# EAGLE design 8-Bit Instruction Register (EAGLE 7.5.0)
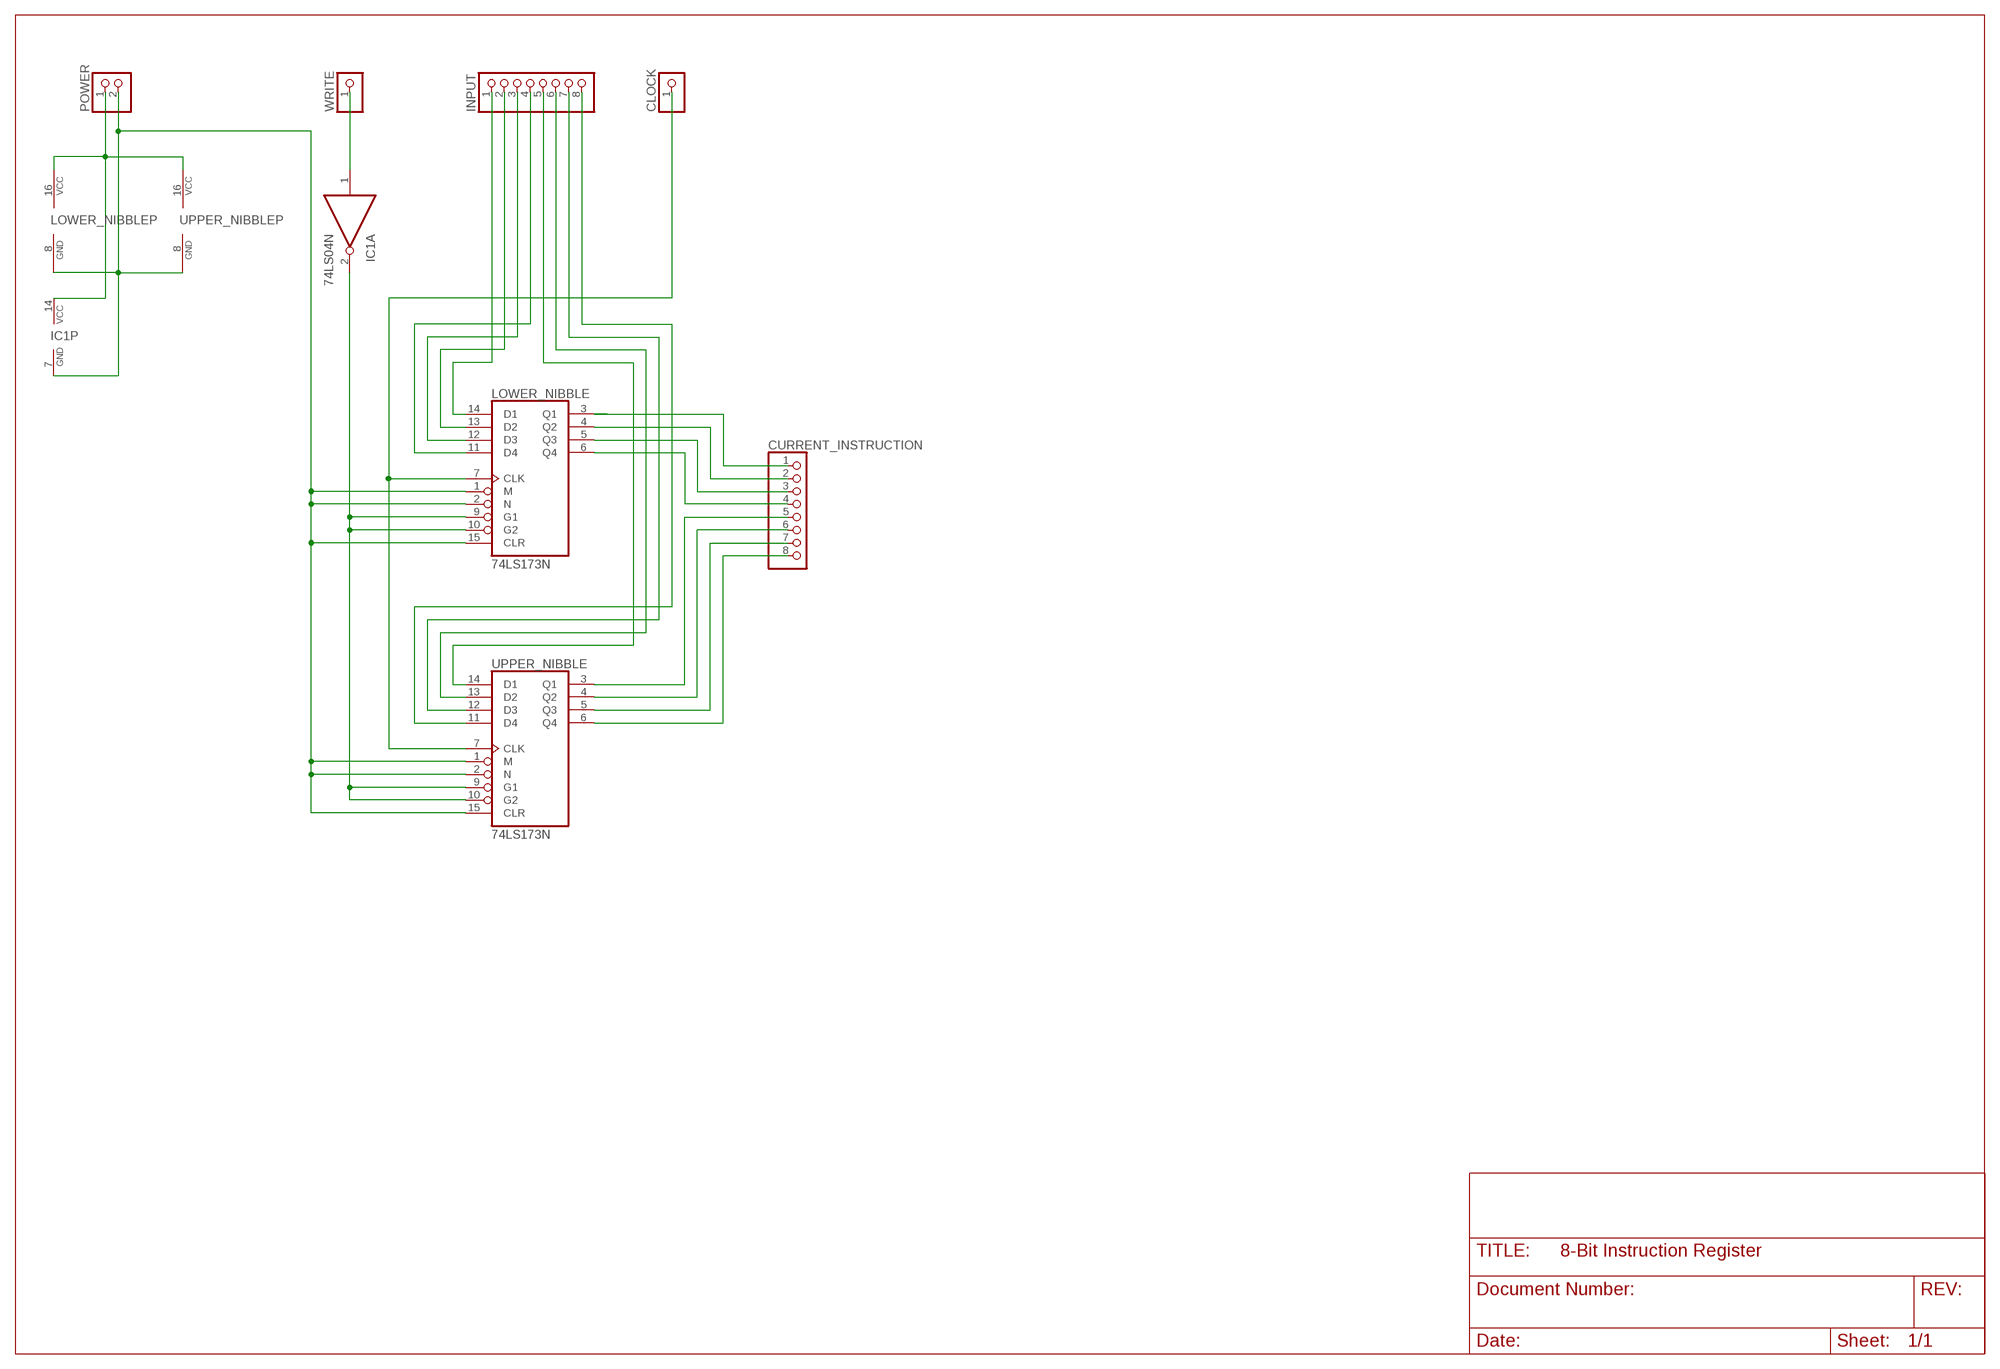
[diagram p0: schematic, sheet 1]

## Parts
CLOCK  PINHD-1X1  [1X01]
CURRENT_INSTRUCTION  PINHD-1X8  [1X08]
IC1  74LS04N  [DIL14]
INPUT  PINHD-1X8  [1X08]
LOWER_NIBBLE  74LS173N  [DIL16]
POWER  PINHD-1X2  [1X02]
UPPER_NIBBLE  74LS173N  [DIL16]
WRITE  PINHD-1X1  [1X01]

## Nets
GND: IC1.7(P:GND) LOWER_NIBBLE.1(M) LOWER_NIBBLE.2(N) LOWER_NIBBLE.8(GND) LOWER_NIBBLE.15(CLR) POWER.2 UPPER_NIBBLE.1(M) UPPER_NIBBLE.2(N) UPPER_NIBBLE.8(GND) UPPER_NIBBLE.15(CLR)
N$2: IC1.1(A:I) WRITE.1
N$11: CURRENT_INSTRUCTION.4 LOWER_NIBBLE.6(Q4)
N$12: IC1.2(A:O) LOWER_NIBBLE.9(G1) LOWER_NIBBLE.10(G2) UPPER_NIBBLE.9(G1) UPPER_NIBBLE.10(G2)
N$13: CLOCK.1 LOWER_NIBBLE.7(CLK) UPPER_NIBBLE.7(CLK)
N$14: INPUT.1 LOWER_NIBBLE.14(D1)
N$15: INPUT.2 LOWER_NIBBLE.13(D2)
N$16: INPUT.3 LOWER_NIBBLE.12(D3)
N$17: INPUT.4 LOWER_NIBBLE.11(D4)
N$18: INPUT.6 UPPER_NIBBLE.13(D2)
N$19: INPUT.5 UPPER_NIBBLE.14(D1)
N$20: INPUT.7 UPPER_NIBBLE.12(D3)
N$21: INPUT.8 UPPER_NIBBLE.11(D4)
N$29: CURRENT_INSTRUCTION.8 UPPER_NIBBLE.6(Q4)
N$31: CURRENT_INSTRUCTION.1 LOWER_NIBBLE.3(Q1)
N$32: CURRENT_INSTRUCTION.2 LOWER_NIBBLE.4(Q2)
N$33: CURRENT_INSTRUCTION.3 LOWER_NIBBLE.5(Q3)
N$35: CURRENT_INSTRUCTION.5 UPPER_NIBBLE.3(Q1)
N$36: CURRENT_INSTRUCTION.6 UPPER_NIBBLE.4(Q2)
N$37: CURRENT_INSTRUCTION.7 UPPER_NIBBLE.5(Q3)
VCC: IC1.14(P:VCC) LOWER_NIBBLE.16(VCC) POWER.1 UPPER_NIBBLE.16(VCC)
Unconnected: IC1.3(B:I) IC1.4(B:O) IC1.5(C:I) IC1.6(C:O) IC1.8(D:O) IC1.9(D:I) IC1.10(E:O) IC1.11(E:I) IC1.12(F:O) IC1.13(F:I)

## Library data of the parts
CLOCK WRITE = pinhead:PINHD-1X1: PIN HEADER
CURRENT_INSTRUCTION INPUT = pinhead:PINHD-1X8: PIN HEADER
IC1 = 74xx-eu:74*04: Hex INVERTER
LOWER_NIBBLE UPPER_NIBBLE = 74xx-us:74*173: 4-bit D type REGISTER, 3-state
POWER = pinhead:PINHD-1X2: PIN HEADER

## Board
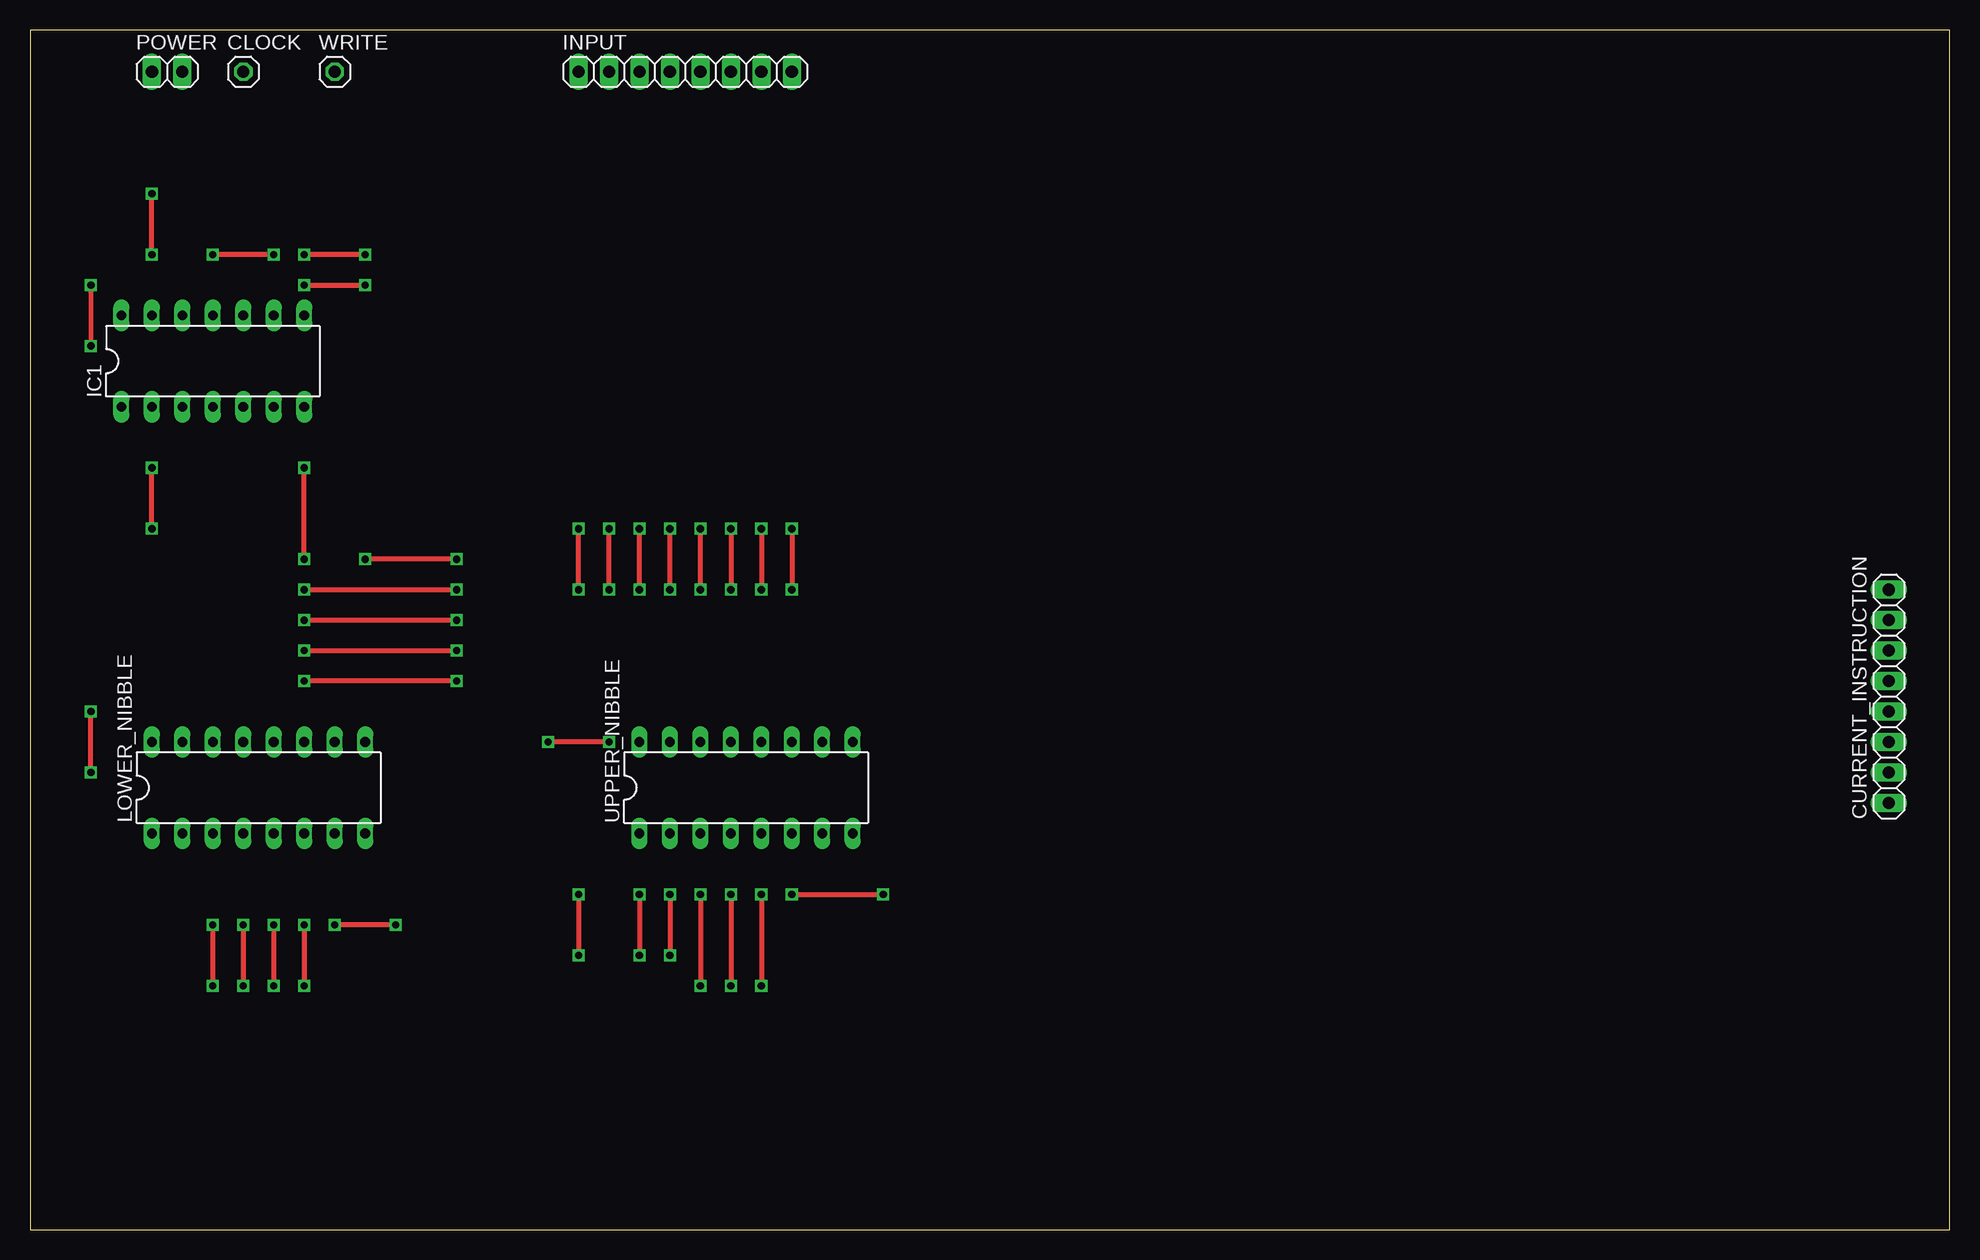
[diagram p1: board, top side]
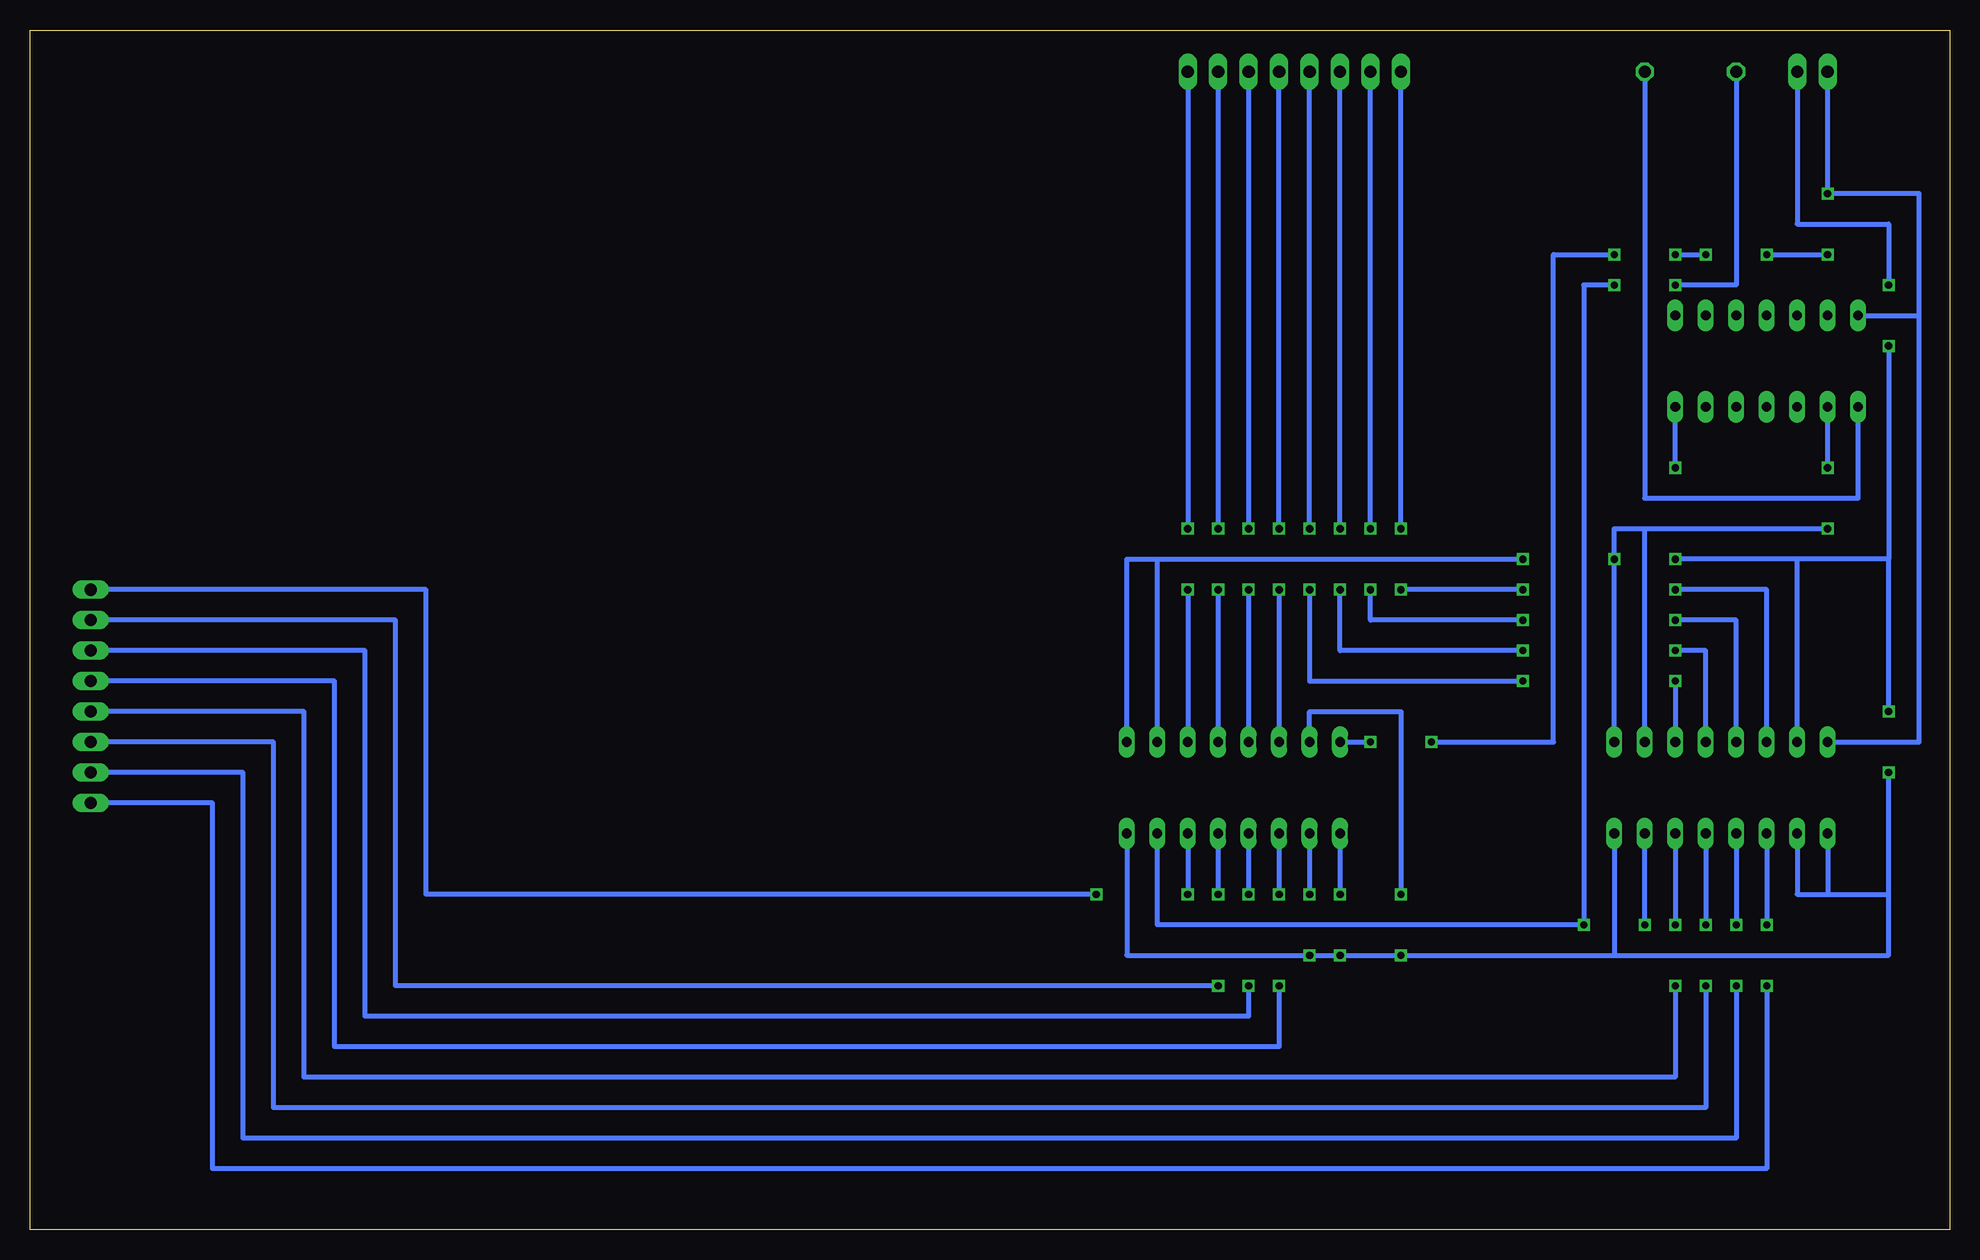
[diagram p2: board, bottom side, seen from below]

Size 160 x 100 mm. Coordinates in mm from the lower left corner, seen from the top.
Outline: 0,0 160,0 160,100 0,100 0,0
Copper layers (1*16): Top 0.035mm / dielectric 1.5mm / Bottom 0.035mm
Design rules "default": minimum track width 10mil, minimum drill 24mil, track to track 8mil, track to pad 8mil, pad to pad 8mil, via to via 8mil, smd to smd 8mil, copper to edge 40mil, drill to drill 8mil, minimum pad ring 10mil, minimum via ring 8mil, stop-mask expansion 4mil, vias tented up to drill 0mil, thermal gap 10mil

### Footprints (pad centres in the part's own frame; a part is rotated, then mirrored left to right if it is on the bottom)
1X01 = drill 1.016 octagon: 1 0,0
1X08 = drill 1.016 long: 1 -8.89,0; 2 -6.35,0; 3 -3.81,0; 4 -1.27,0; 5 1.27,0; 6 3.81,0; 7 6.35,0; 8 8.89,0
DIL14 = drill 0.813 long: 1 -7.62,-3.81; 2 -5.08,-3.81; 3 -2.54,-3.81; 4 0,-3.81; 5 2.54,-3.81; 6 5.08,-3.81; 7 7.62,-3.81; 8 7.62,3.81; 9 5.08,3.81; 10 2.54,3.81; 11 0,3.81; 12 -2.54,3.81; 13 -5.08,3.81; 14 -7.62,3.81
DIL16 = drill 0.813 long: 1 -8.89,-3.81; 2 -6.35,-3.81; 3 -3.81,-3.81; 4 -1.27,-3.81; 5 1.27,-3.81; 6 3.81,-3.81; 7 6.35,-3.81; 8 8.89,-3.81; 9 8.89,3.81; 10 6.35,3.81; 11 3.81,3.81; 12 1.27,3.81; 13 -1.27,3.81; 14 -3.81,3.81; 15 -6.35,3.81; 16 -8.89,3.81
1X02 = drill 1.016 long: 1 -1.27,0; 2 1.27,0

### Placement (x,y rotation side)
CLOCK  17.78,96.52 0 top
CURRENT_INSTRUCTION  154.94,44.45 90 top
IC1  15.24,72.39 0 top
INPUT  54.61,96.52 0 top
LOWER_NIBBLE  19.05,36.83 0 top
POWER  11.43,96.52 0 top
UPPER_NIBBLE  59.69,36.83 0 top
WRITE  25.4,96.52 0 top

### Tracks (layer width: path | path; a pad name or v marks a point on that pad's centre or on a via)
GND  (via drill 0.6)
  Top 0.406: v5.08,78.74 v5.08,73.66 | v22.86,55.88 v22.86,63.5 | v5.08,38.1 v5.08,43.18 | v50.8,27.94 v50.8,22.86 | v53.34,27.94 v53.34,22.86 | v45.72,27.94 v45.72,22.86
  Bottom 0.406: POWER.2 12.7,83.82 5.08,83.82 v5.08,78.74 | v5.08,73.66 5.08,55.88 | 5.08,55.88 12.7,55.88 | 12.7,55.88 v22.86,55.88 | v22.86,63.5 IC1.7 | LOWER_NIBBLE.15 12.7,55.88 | LOWER_NIBBLE.1 10.16,27.94 | 10.16,27.94 5.08,27.94 | 5.08,27.94 v5.08,38.1 | v5.08,43.18 5.08,55.88 | LOWER_NIBBLE.2 12.7,27.94 10.16,27.94 | LOWER_NIBBLE.8 27.94,22.86 | 27.94,22.86 5.08,22.86 5.08,27.94 | UPPER_NIBBLE.1 v50.8,27.94 | UPPER_NIBBLE.2 v53.34,27.94 | UPPER_NIBBLE.8 68.58,22.86 v53.34,22.86 v50.8,22.86 v45.72,22.86 27.94,22.86 | UPPER_NIBBLE.15 53.34,43.18 45.72,43.18 v45.72,27.94
N$2
  Bottom 0.406: WRITE.1 25.4,60.96 7.62,60.96 IC1.1
N$11  (via drill 0.6)
  Top 0.406: v22.86,25.4 v22.86,20.32
  Bottom 0.406: LOWER_NIBBLE.6 v22.86,25.4 | CURRENT_INSTRUCTION.4 137.16,43.18 137.16,12.7 22.86,12.7 v22.86,20.32
N$12  (via drill 0.6)
  Top 0.406: v35.56,55.88 v27.94,55.88 | v10.16,58.42 v10.16,63.5
  Bottom 0.406: UPPER_NIBBLE.10 66.04,55.88 | 66.04,55.88 v35.56,55.88 | 25.4,58.42 v10.16,58.42 | v10.16,63.5 IC1.2 | LOWER_NIBBLE.9 v27.94,55.88 27.94,58.42 25.4,58.42 | LOWER_NIBBLE.10 25.4,58.42 | UPPER_NIBBLE.9 68.58,55.88 66.04,55.88
N$13  (via drill 0.6)
  Top 0.406: v22.86,78.74 v27.94,78.74 | v30.48,25.4 v25.4,25.4
  Bottom 0.406: v22.86,78.74 17.78,78.74 CLOCK.1 | v27.94,78.74 30.48,78.74 v30.48,25.4 66.04,25.4 UPPER_NIBBLE.7 | v25.4,25.4 LOWER_NIBBLE.7
N$14  (via drill 0.6)
  Top 0.406: v22.86,53.34 v35.56,53.34 | v45.72,53.34 v45.72,58.42
  Bottom 0.406: LOWER_NIBBLE.14 15.24,53.34 v22.86,53.34 | v35.56,53.34 v45.72,53.34 | v45.72,58.42 INPUT.1
N$15  (via drill 0.6)
  Top 0.406: v22.86,50.8 v35.56,50.8 | v48.26,53.34 v48.26,58.42
  Bottom 0.406: LOWER_NIBBLE.13 17.78,50.8 v22.86,50.8 | v35.56,50.8 48.26,50.8 v48.26,53.34 | v48.26,58.42 INPUT.2
N$16  (via drill 0.6)
  Top 0.406: v22.86,48.26 v35.56,48.26 | v50.8,53.34 v50.8,58.42
  Bottom 0.406: LOWER_NIBBLE.12 20.32,48.26 v22.86,48.26 | v35.56,48.26 50.8,48.26 v50.8,53.34 | v50.8,58.42 INPUT.3
N$17  (via drill 0.6)
  Top 0.406: v35.56,45.72 v22.86,45.72 | v53.34,53.34 v53.34,58.42
  Bottom 0.406: v35.56,45.72 53.34,45.72 v53.34,53.34 | v22.86,45.72 LOWER_NIBBLE.11 | v53.34,58.42 INPUT.4
N$18  (via drill 0.6)
  Top 0.406: v58.42,58.42 v58.42,53.34
  Bottom 0.406: INPUT.6 v58.42,58.42 | v58.42,53.34 UPPER_NIBBLE.13
N$19  (via drill 0.6)
  Top 0.406: v55.88,53.34 v55.88,58.42
  Bottom 0.406: v55.88,53.34 UPPER_NIBBLE.14 | v55.88,58.42 INPUT.5
N$20  (via drill 0.6)
  Top 0.406: v60.96,58.42 v60.96,53.34
  Bottom 0.406: v60.96,53.34 UPPER_NIBBLE.12 | INPUT.7 v60.96,58.42
N$21  (via drill 0.6)
  Top 0.406: v63.5,58.42 v63.5,53.34
  Bottom 0.406: INPUT.8 v63.5,58.42 | v63.5,53.34 UPPER_NIBBLE.11
N$29  (via drill 0.6)
  Top 0.406: v63.5,27.94 v71.12,27.94
  Bottom 0.406: UPPER_NIBBLE.6 v63.5,27.94 | v71.12,27.94 127,27.94 127,53.34 CURRENT_INSTRUCTION.8
N$31  (via drill 0.6)
  Top 0.406: v15.24,25.4 v15.24,20.32
  Bottom 0.406: LOWER_NIBBLE.3 v15.24,25.4 | v15.24,20.32 15.24,5.08 144.78,5.08 144.78,35.56 CURRENT_INSTRUCTION.1
N$32  (via drill 0.6)
  Top 0.406: v17.78,25.4 v17.78,20.32
  Bottom 0.406: LOWER_NIBBLE.4 v17.78,25.4 | v17.78,20.32 17.78,7.62 142.24,7.62 142.24,38.1 CURRENT_INSTRUCTION.2
N$33  (via drill 0.6)
  Top 0.406: v20.32,25.4 v20.32,20.32
  Bottom 0.406: LOWER_NIBBLE.5 v20.32,25.4 | v20.32,20.32 20.32,10.16 139.7,10.16 139.7,40.64 CURRENT_INSTRUCTION.3
N$35  (via drill 0.6)
  Top 0.406: v55.88,27.94 v55.88,20.32
  Bottom 0.406: UPPER_NIBBLE.3 v55.88,27.94 | v55.88,20.32 55.88,15.24 134.62,15.24 134.62,45.72 CURRENT_INSTRUCTION.5
N$36  (via drill 0.6)
  Top 0.406: v58.42,27.94 v58.42,20.32
  Bottom 0.406: UPPER_NIBBLE.4 v58.42,27.94 | v58.42,20.32 58.42,17.78 132.08,17.78 132.08,48.26 CURRENT_INSTRUCTION.6
N$37  (via drill 0.6)
  Top 0.406: v60.96,27.94 v60.96,20.32
  Bottom 0.406: UPPER_NIBBLE.5 v60.96,27.94 | v60.96,20.32 129.54,20.32 129.54,50.8 CURRENT_INSTRUCTION.7
VCC  (via drill 0.6)
  Top 0.406: v48.26,40.64 v43.18,40.64 | v27.94,81.28 v22.86,81.28 | v20.32,81.28 v15.24,81.28 | v10.16,81.28 v10.16,86.36
  Bottom 0.406: IC1.14 2.54,76.2 | 2.54,76.2 2.54,86.36 v10.16,86.36 10.16,88.9 POWER.1 | LOWER_NIBBLE.16 2.54,40.64 2.54,76.2 | UPPER_NIBBLE.16 v48.26,40.64 | v43.18,40.64 33.02,40.64 33.02,81.28 v27.94,81.28 | v22.86,81.28 v20.32,81.28 | v15.24,81.28 v10.16,81.28